# EAGLE design turntable_final (EAGLE 8.1.0)
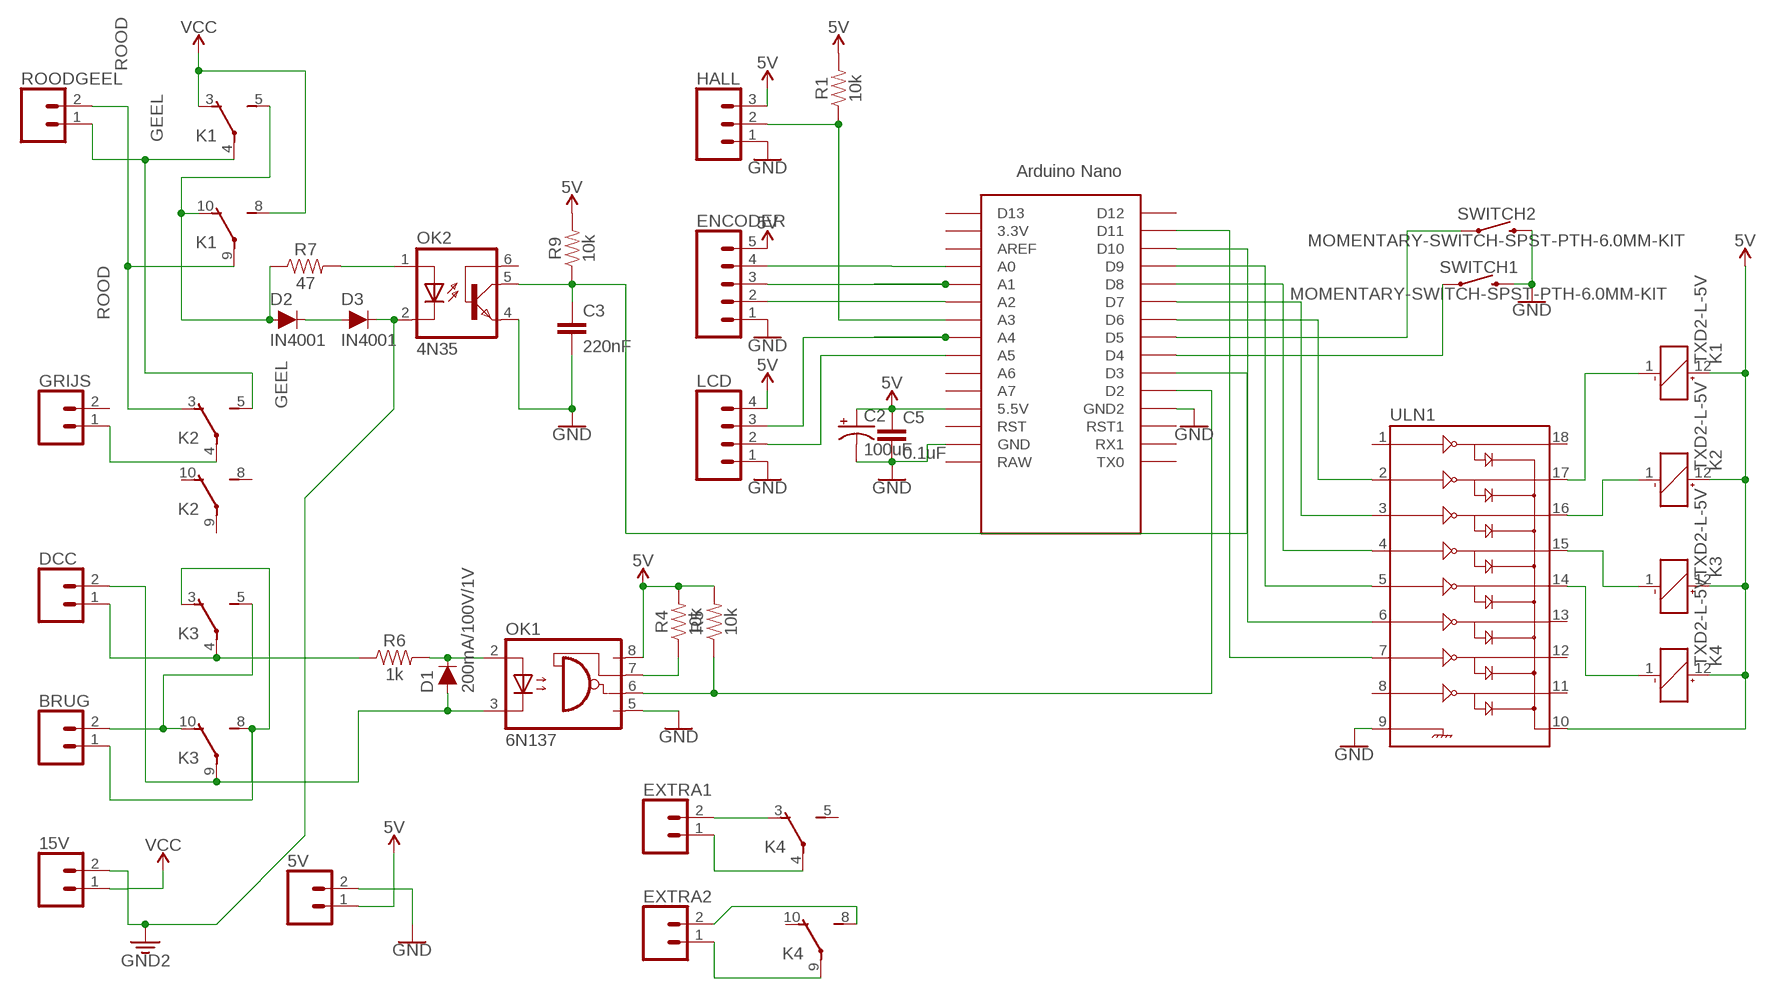
[diagram p0: schematic, sheet 1]

## Parts
5V  CONN_023.5MM_LOCK  [SCREWTERMINAL-3.5MM-2_LOCK]
15V  CONN_023.5MM_LOCK  [SCREWTERMINAL-3.5MM-2_LOCK]
BRUG  CONN_023.5MM_LOCK  [SCREWTERMINAL-3.5MM-2_LOCK]
C2  100uF  10UF-POLAR-RADIAL-2.5MM-25V-20%  [CPOL-RADIAL-2.5MM-5MM]
C3  220nF  0.1UF-KIT-EZ-50V-20%  [CAP-PTH-SMALL-KIT]
C5  0.1uF  0.1UF-KIT-EZ-50V-20%  [CAP-PTH-SMALL-KIT]
D1  200mA/100V/1V  DIODE-1N4148  [DIODE-1N4148]
D2  IN4001  DIODE-PTH  [DIODE-1N4001]
D3  IN4001  DIODE-PTH  [DIODE-1N4001]
DCC  CONN_023.5MM_LOCK  [SCREWTERMINAL-3.5MM-2_LOCK]
ENCODER  CONN_05  [1X05]
EXTRA1  CONN_023.5MM_LOCK  [SCREWTERMINAL-3.5MM-2_LOCK]
EXTRA2  CONN_023.5MM_LOCK  [SCREWTERMINAL-3.5MM-2_LOCK]
GRIJS  CONN_023.5MM_LOCK  [SCREWTERMINAL-3.5MM-2_LOCK]
HALL  CONN_03  [1X03]
K1  TXD2-L-5V  [TXD2]
K2  TXD2-L-5V  [TXD2]
K3  TXD2-L-5V  [TXD2]
K4  TXD2-L-5V  [TXD2]
LCD  CONN_04  [1X04]
OK1  6N137  [DIL08]
OK2  4N35  [DIL06]
R1  10k  10KOHM-HORIZ-1/4W-1%  [AXIAL-0.3]
R4  10k  10KOHM-HORIZ-1/4W-1%  [AXIAL-0.3]
R5  10k  10KOHM-HORIZ-1/4W-1%  [AXIAL-0.3]
R6  1k  1KOHM-HORIZ-1/4W-1%  [AXIAL-0.3]
R7  47  100OHM-HORIZ-1/4W-1%  [AXIAL-0.3]
R9  10k  10KOHM-HORIZ-1/4W-1%  [AXIAL-0.3]
ROODGEEL  CONN_023.5MM_LOCK  [SCREWTERMINAL-3.5MM-2_LOCK]
SWITCH1  MOMENTARY-SWITCH-SPST-PTH-6.0MM-KIT  [TACTILE_SWITCH_PTH_6.0MM_KIT]
SWITCH2  MOMENTARY-SWITCH-SPST-PTH-6.0MM-KIT  [TACTILE_SWITCH_PTH_6.0MM_KIT]
U$1  NANO  [NANO]
ULN1  ULN2803DIP  [DIL18]

## Nets
5V: 5V.1 C2.1(+) C5.1 ENCODER.5 HALL.3 K1.12(_:+) K2.12(_:+) K3.12(_:+) K4.12(_:+) LCD.4 OK1.8(VCC) R1.P$2 R4.P$2 R5.P$2 R9.P$2 U$1.5V(5.5V) ULN1.10
GEEL: K1.4(P) K2.5(S) ROODGEEL.1
GND: 5V.2 C2.2(-) C3.2 C5.2 ENCODER.1 HALL.1 LCD.1 OK1.5(GND) OK2.4(EMI) SWITCH1.3 SWITCH2.3 U$1.GND U$1.GND1(GND2) ULN1.9
GND2: 15V.2 D3.C OK2.2(C)
N$1: HALL.2 R1.P$1 U$1.A3
N$2: K3.1(_:-) ULN1.15
N$4: K1.1(_:-) ULN1.17
N$5: ENCODER.3 U$1.A1
N$6: EXTRA2.1 K4.9(P)
N$7: K4.1(_:-) ULN1.14
N$8: OK1.7(VE) R4.P$1
N$9: DCC.1 K3.4(P) R6.P$1
N$10: D1.A DCC.2 K3.9(P) OK1.3(C)
N$11: ENCODER.4 U$1.A0
N$12: K2.1(_:-) ULN1.16
N$13: OK1.6(VO) R5.P$1 U$1.D2
N$14: D1.C OK1.2(A) R6.P$2
N$15: ENCODER.2 U$1.A2
N$16: BRUG.2 K3.5(S) K3.10(O)
N$17: BRUG.1 K3.3(O) K3.8(S)
N$18: D2.C D3.A
N$19: U$1.D10 ULN1.6
N$20: OK2.1(A) R7.P$2
N$21: EXTRA1.2 K4.3(O)
N$22: C3.1 OK2.5(COL) R9.P$1 U$1.D3
N$23: SWITCH1.1 U$1.D4
N$24: SWITCH2.1 U$1.D5
N$25: GRIJS.1 K2.4(P)
N$26: EXTRA1.1 K4.4(P)
N$27: D2.A K1.5(S) K1.10(O) R7.P$1
N$28: EXTRA2.2 K4.8(S)
N$29: U$1.D9 ULN1.5
N$30: U$1.D8 ULN1.4
N$31: U$1.D7 ULN1.3
N$32: U$1.D6 ULN1.2
N$33: LCD.3 U$1.A4
N$34: LCD.2 U$1.A5
N$35: U$1.D11 ULN1.7
ROOD: K1.9(P) K2.3(O) ROODGEEL.2
VCC: 15V.1 K1.3(O) K1.8(S)
Unconnected: GRIJS.2 K2.8(S) K2.9(P) K2.10(O) K4.5(S) K4.10(O) OK2.6(BAS) U$1.3.3V U$1.A6 U$1.A7 U$1.AREF U$1.D12 U$1.D13 U$1.ICSP1 U$1.ICSP2 U$1.ICSP3 U$1.ICSP4 U$1.ICSP5 U$1.ICSP6 U$1.RAW U$1.RST U$1.RST1 U$1.RX1 U$1.TX0 ULN1.1 ULN1.8 ULN1.11 ULN1.12 ULN1.13 ULN1.18

## Library data of the parts
5V 15V BRUG DCC EXTRA1 EXTRA2 GRIJS ROODGEEL = SparkFun-Connectors:CONN_02: Multi connection point. Often used as Generic Header-pin footprint for 0.1 inch spaced/style header connections On any of the 0.1 inch spaced packages, you can populate with these: Break Away Headers - Straight <https://www.sparkfun.com/products/116> (PRT-00116) Break Away Male Headers - Right Angle <https://www.sparkfun.com/products/553> (PRT-00553) Female Headers <https://www.sparkfun.com/products/115> (PRT-00115) Break Away Headers - Machine Pin <https://www.sparkfun.com/products/117> (PRT-00117) Break Away Female Headers - Swiss Machine Pin <https://www.sparkfun.com/products/743> (PRT-00743) For SCREWTERMINALS and SPRING TERMINALS visit here: Screw Terimnals on SparkFun.com <https://www.sparkfun.com/search/results?term=Screw+Terminals> (5mm/3.5mm/2.54mm spacing) This device is also useful as a general connection point to wire up your design to another part of your project. Our various solder wires solder well into these plated through hole pads. Hook-Up Wire - Assortment (Stranded, 22 AWG) <https://www.sparkfun.com/products/11375> (PRT-11375) Hook-Up Wire - Assortment (Solid Core, 22 AWG) <https://www.sparkfun.com/products/11367> (PRT-11367) View the entire wire category on our website here <https://www.sparkfun.com/categories/141> Special notes: Molex polarized connector foot print use with: PRT-08233 with associated crimp pins and housings. 2.54_SCREWTERM for use with PRT-10571. 3.5mm Screw Terminal footprints for PRT-08084 5mm Screw Terminal footprints for use with PRT-08432; PROD_ID: CONN-08399
C2 = SparkFun-Capacitors:10UF-POLAR: 10.0µF polarized capacitors A capacitor is a passive two-terminal electrical component used to store electrical energy temporarily in an electric field.; PROD_ID: CAP-08440; VALUE: 10uF
C3 = SparkFun-Capacitors:0.1UF: 0.1µF ceramic capacitors A capacitor is a passive two-terminal electrical component used to store electrical energy temporarily in an electric field.; PROD_ID: CAP-08370; VALUE: 0.1uF
C5 = SparkFun-Capacitors:0.1UF: 0.1µF ceramic capacitors A capacitor is a passive two-terminal electrical component used to store electrical energy temporarily in an electric field.; PROD_ID: CAP-08370
D1 = SparkFun-DiscreteSemi:DIODE: Diode These are standard reverse protection diodes and small signal diodes. SparkFun Products: SparkFun SparkPunk Sound Kit <https://www.sparkfun.com/products/11177> SparkFun ESP8266 Thing <https://www.sparkfun.com/products/13231>; PROD_ID: DIO-08378
D2 D3 = SparkFun-DiscreteSemi:DIODE: Diode These are standard reverse protection diodes and small signal diodes. SparkFun Products: SparkFun SparkPunk Sound Kit <https://www.sparkfun.com/products/11177> SparkFun ESP8266 Thing <https://www.sparkfun.com/products/13231>; PROD_ID: DIO-09176; VALUE: 1A/50V/1.1V
ENCODER = SparkFun-Connectors:CONN_05: Multi connection point. Often used as Generic Header-pin footprint for 0.1 inch spaced/style header connections On any of the 0.1 inch spaced packages, you can populate with these: Break Away Headers - Straight <https://www.sparkfun.com/products/116> (PRT-00116) Break Away Male Headers - Right Angle <https://www.sparkfun.com/products/553> (PRT-00553) Female Headers <https://www.sparkfun.com/products/115> (PRT-00115) Break Away Headers - Machine Pin <https://www.sparkfun.com/products/117> (PRT-00117) Break Away Female Headers - Swiss Machine Pin <https://www.sparkfun.com/products/743> (PRT-00743) For SCREWTERMINALS and SPRING TERMINALS visit here: Screw Terimnals on SparkFun.com <https://www.sparkfun.com/search/results?term=Screw+Terminals> (5mm/3.5mm/2.54mm spacing) This device is also useful as a general connection point to wire up your design to another part of your project. Our various solder wires solder well into these plated through hole pads. Hook-Up Wire - Assortment (Stranded, 22 AWG) <https://www.sparkfun.com/products/11375> (PRT-11375) Hook-Up Wire - Assortment (Solid Core, 22 AWG) <https://www.sparkfun.com/products/11367> (PRT-11367) View the entire wire category on our website here <https://www.sparkfun.com/categories/141> Special notes: Molex polarized connector foot print use with SKU : PRT-08231 with associated crimp pins and housings. 1MM SMD Version SKU: PRT-10208
HALL = SparkFun-Connectors:CONN_03: Multi connection point. Often used as Generic Header-pin footprint for 0.1 inch spaced/style header connections On any of the 0.1 inch spaced packages, you can populate with these: Break Away Headers - Straight <https://www.sparkfun.com/products/116> (PRT-00116) Break Away Male Headers - Right Angle <https://www.sparkfun.com/products/553> (PRT-00553) Female Headers <https://www.sparkfun.com/products/115> (PRT-00115) Break Away Headers - Machine Pin <https://www.sparkfun.com/products/117> (PRT-00117) Break Away Female Headers - Swiss Machine Pin <https://www.sparkfun.com/products/743> (PRT-00743) Stackable Header - 3 Pin (Female, 0.1") <https://www.sparkfun.com/products/13875> (PRT-13875) For SCREWTERMINALS and SPRING TERMINALS visit here: Screw Terimnals on SparkFun.com <https://www.sparkfun.com/search/results?term=Screw+Terminals> (5mm/3.5mm/2.54mm spacing) This device is also useful as a general connection point to wire up your design to another part of your project. Our various solder wires solder well into these plated through hole pads. Hook-Up Wire - Assortment (Stranded, 22 AWG) <https://www.sparkfun.com/products/11375> (PRT-11375) Hook-Up Wire - Assortment (Solid Core, 22 AWG) <https://www.sparkfun.com/products/11367> (PRT-11367) View the entire wire category on our website here <https://www.sparkfun.com/categories/141> Special notes: Molex polarized connector foot print use with SKU : PRT-08232 with associated crimp pins and housings.
K1-K4 = relay:TX?-*: TX Relais NAiS TX-D RELAYS HIGH INSULATION Conforming to the supplementary insulation class of EN Standards (EN41003) Source: http://www.mew-europe.com/.. en_ds_61022_0007.pdf TX-S RELAYS SMALL POLARIZED RELAY WITH HIGH SENSITIVITY 50mW Source: http://www.mew-europe.com/.. en_ds_61022_0022.pdf; OC_FARNELL: unknown; OC_NEWARK: unknown
LCD = SparkFun-Connectors:CONN_04: Multi connection point. Often used as Generic Header-pin footprint for 0.1 inch spaced/style header connections On any of the 0.1 inch spaced packages, you can populate with these: Break Away Headers - Straight <https://www.sparkfun.com/products/116> (PRT-00116) Break Away Male Headers - Right Angle <https://www.sparkfun.com/products/553> (PRT-00553) Female Headers <https://www.sparkfun.com/products/115> (PRT-00115) Break Away Headers - Machine Pin <https://www.sparkfun.com/products/117> (PRT-00117) Break Away Female Headers - Swiss Machine Pin <https://www.sparkfun.com/products/743> (PRT-00743) For SCREWTERMINALS and SPRING TERMINALS visit here: Screw Terimnals on SparkFun.com <https://www.sparkfun.com/search/results?term=Screw+Terminals> (5mm/3.5mm/2.54mm spacing) This device is also useful as a general connection point to wire up your design to another part of your project. Our various solder wires solder well into these plated through hole pads. Hook-Up Wire - Assortment (Stranded, 22 AWG) <https://www.sparkfun.com/products/11375> (PRT-11375) Hook-Up Wire - Assortment (Solid Core, 22 AWG) <https://www.sparkfun.com/products/11367> (PRT-11367) View the entire wire category on our website here <https://www.sparkfun.com/categories/141> Special notes: Molex polarized connector foot print use with SKU : PRT-08231 with associated crimp pins and housings. 1MM SMD Version SKU: PRT-10208; PROD_ID: CONN-09696
OK1 = optocoupler:6N137: MOTOROLA OPTO COUPLER; MPN: 6N137; OC_FARNELL: 1328376; OC_NEWARK: 52M1895
OK2 = optocoupler:4N35: MOTOROLA OPTO COUPLER; MF: FAIRCHILD SEMICONDUCTOR; MPN: 4N35; OC_FARNELL: 1328375; OC_NEWARK: 72K9946
R1 R4 R5 R9 = SparkFun-Resistors:10KOHM: 10kΩ resistor A resistor is a passive two-terminal electrical component that implements electrical resistance as a circuit element. Resistors act to reduce current flow, and, at the same time, act to lower voltage levels within circuits. - Wikipedia; PROD_ID: RES-12183
R6 = SparkFun-Resistors:1KOHM: 1kΩ resistor A resistor is a passive two-terminal electrical component that implements electrical resistance as a circuit element. Resistors act to reduce current flow, and, at the same time, act to lower voltage levels within circuits. - Wikipedia; PROD_ID: RES-12182
R7 = SparkFun-Resistors:100OHM: 100Ω resistor A resistor is a passive two-terminal electrical component that implements electrical resistance as a circuit element. Resistors act to reduce current flow, and, at the same time, act to lower voltage levels within circuits. - Wikipedia; PROD_ID: RES-12181; VALUE: 100
SWITCH1 SWITCH2 = SparkFun-Switches:MOMENTARY-SWITCH-SPST: Momentary Switch (Pushbutton) - SPST Normally-open (NO) SPST momentary switches (buttons, pushbuttons). Variants PTH-12MM - 12mm square, through-hole Momentary Pushbutton Switch - 12mm Square <https://www.sparkfun.com/products/9190> (COM-09190) PTH-6.0MM, PTH-6.0MM-KIT - 6.0mm square, through-hole Mini Pushbutton Switch <https://www.sparkfun.com/products/97> (COM-00097) KIT package intended for soldering kit's - only one side of pads' copper is exposed. PTH-RIGHT-ANGLE-KIT - Right-angle, through-hole Right Angle Tactile Button <https://www.sparkfun.com/products/10791> - Used on SparkFun BigTime Watch Kit <https://www.sparkfun.com/products/11734> SMD-12MM - 12mm square, surface-mount Tactile Button - SMD (12mm) <https://www.sparkfun.com/products/12993> (COM-12993) Used on SparkFun PicoBoard <https://www.sparkfun.com/products/11888> SMD-4.5MM - 4.5mm Square Trackball Switch Used on SparkFun Blackberry Trackballer Breakout <https://www.sparkfun.com/products/13169> SMD-4.6MMX2.8MM - 4.60mm x 2.80mm, surface mount Used on SparkFun SAMD21 Mini Breakout <https://www.sparkfun.com/products/13664> SMD-5.2MM, SMD-5.2-REDUNDANT - 5.2mm square, surface-mount Mini Pushbutton Switch - SMD <https://www.sparkfun.com/products/8720> (COM-08720) Used on Arduino Pro Mini <https://www.sparkfun.com/products/11114> REDUNDANT package connects both switch circuits together SMD-6.0X3.5MM - 6.0 x 3.5mm, surface mount Momentary Reset Switch SMD <https://www.sparkfun.com/products/8229> (COM-08229) SMD-6.2MM-TALL - 6.2mm square, surface mount Tactile Button - SMD (6mm) <https://www.sparkfun.com/products/12992> Used on SparkFun Digital Sandbox <https://www.sparkfun.com/products/12651> SMD-RIGHT-ANGLE - Right-angle, surface mount Used on SparkFun Block for Intel® Edison - Arduino <https://www.sparkfun.com/products/13036>; PROD_ID: SWCH-08441; SF_SKU: COM-00097
U$1 = Arduino-clone:NANO: Arduino Nano
ULN1 = SparkFun-IC-Special-Function:ULN2803: Darlington Driver(IC-07959, low stock) ULN2803 Darlington array. 500mA max per channel, 8-channel package. Spark Fun Electronics SKU : COM-00312

## Board
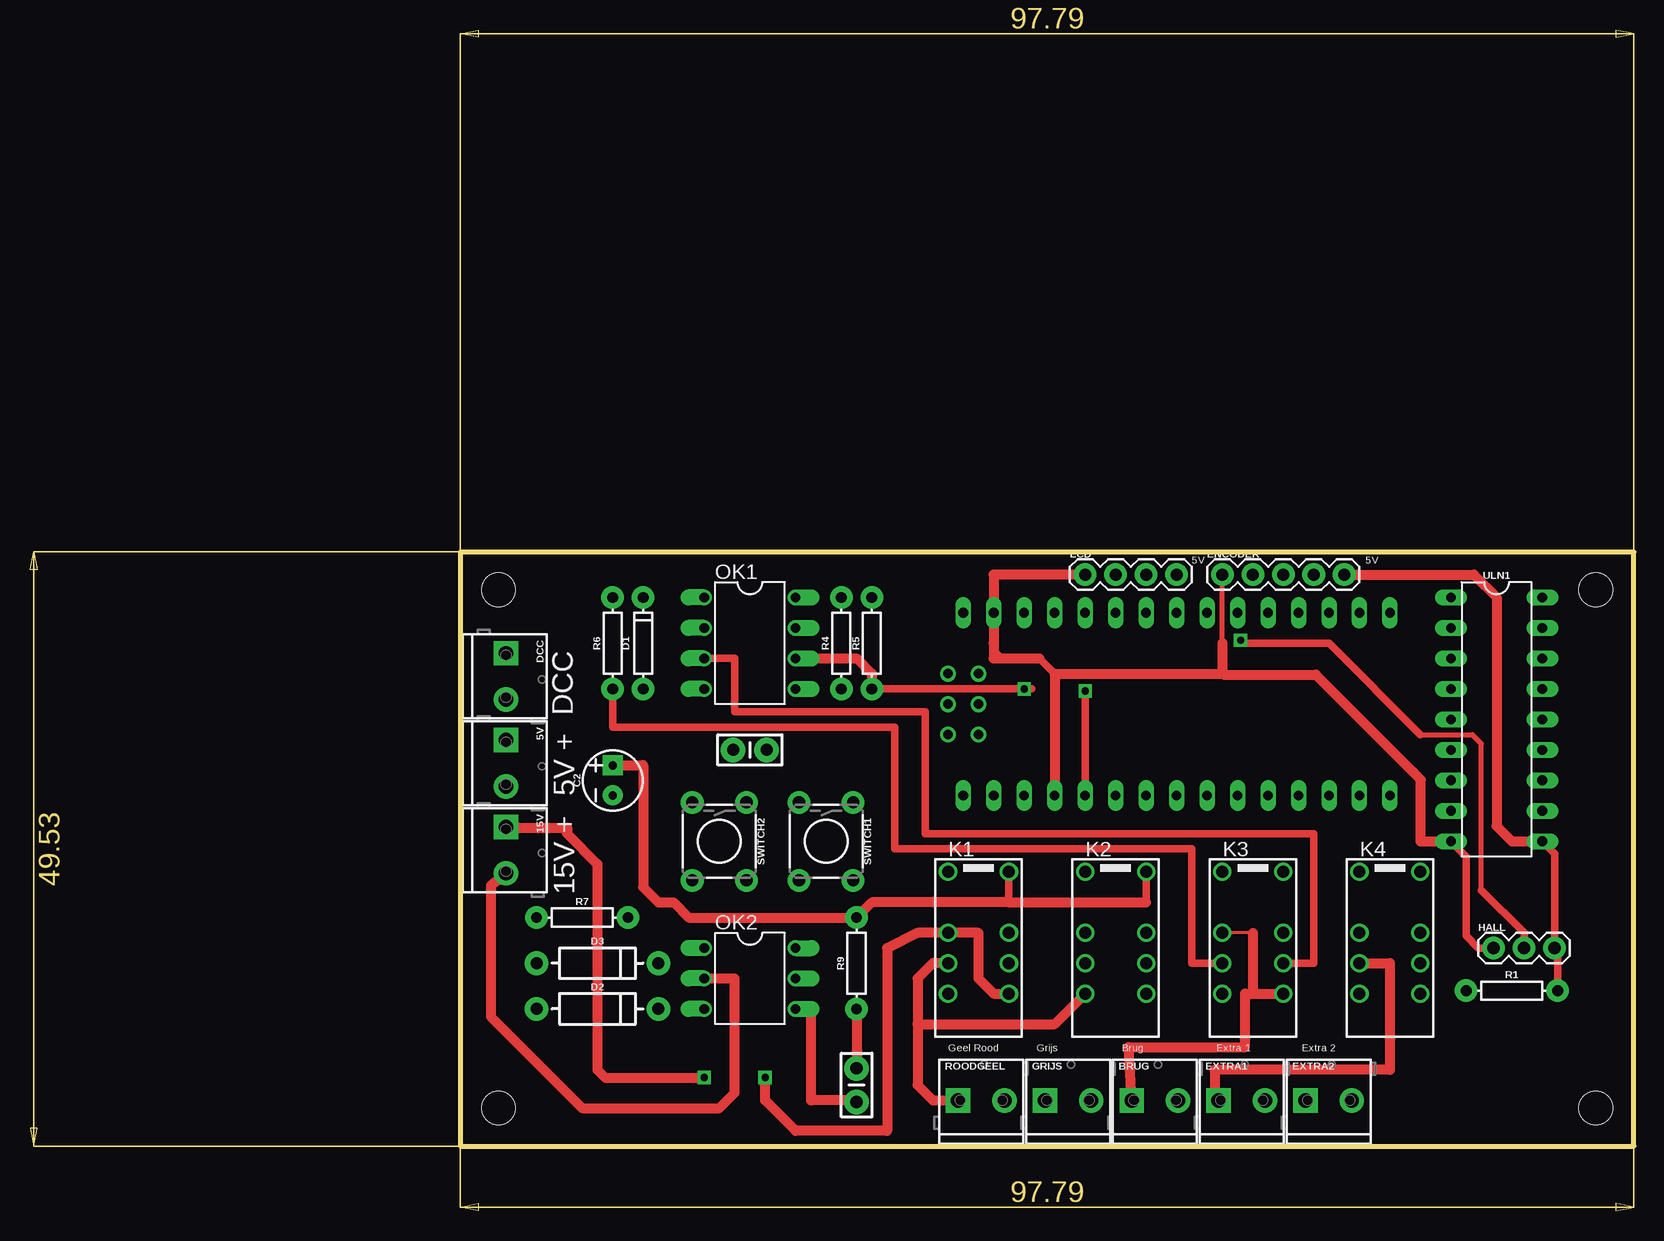
[diagram p1: board, top side]
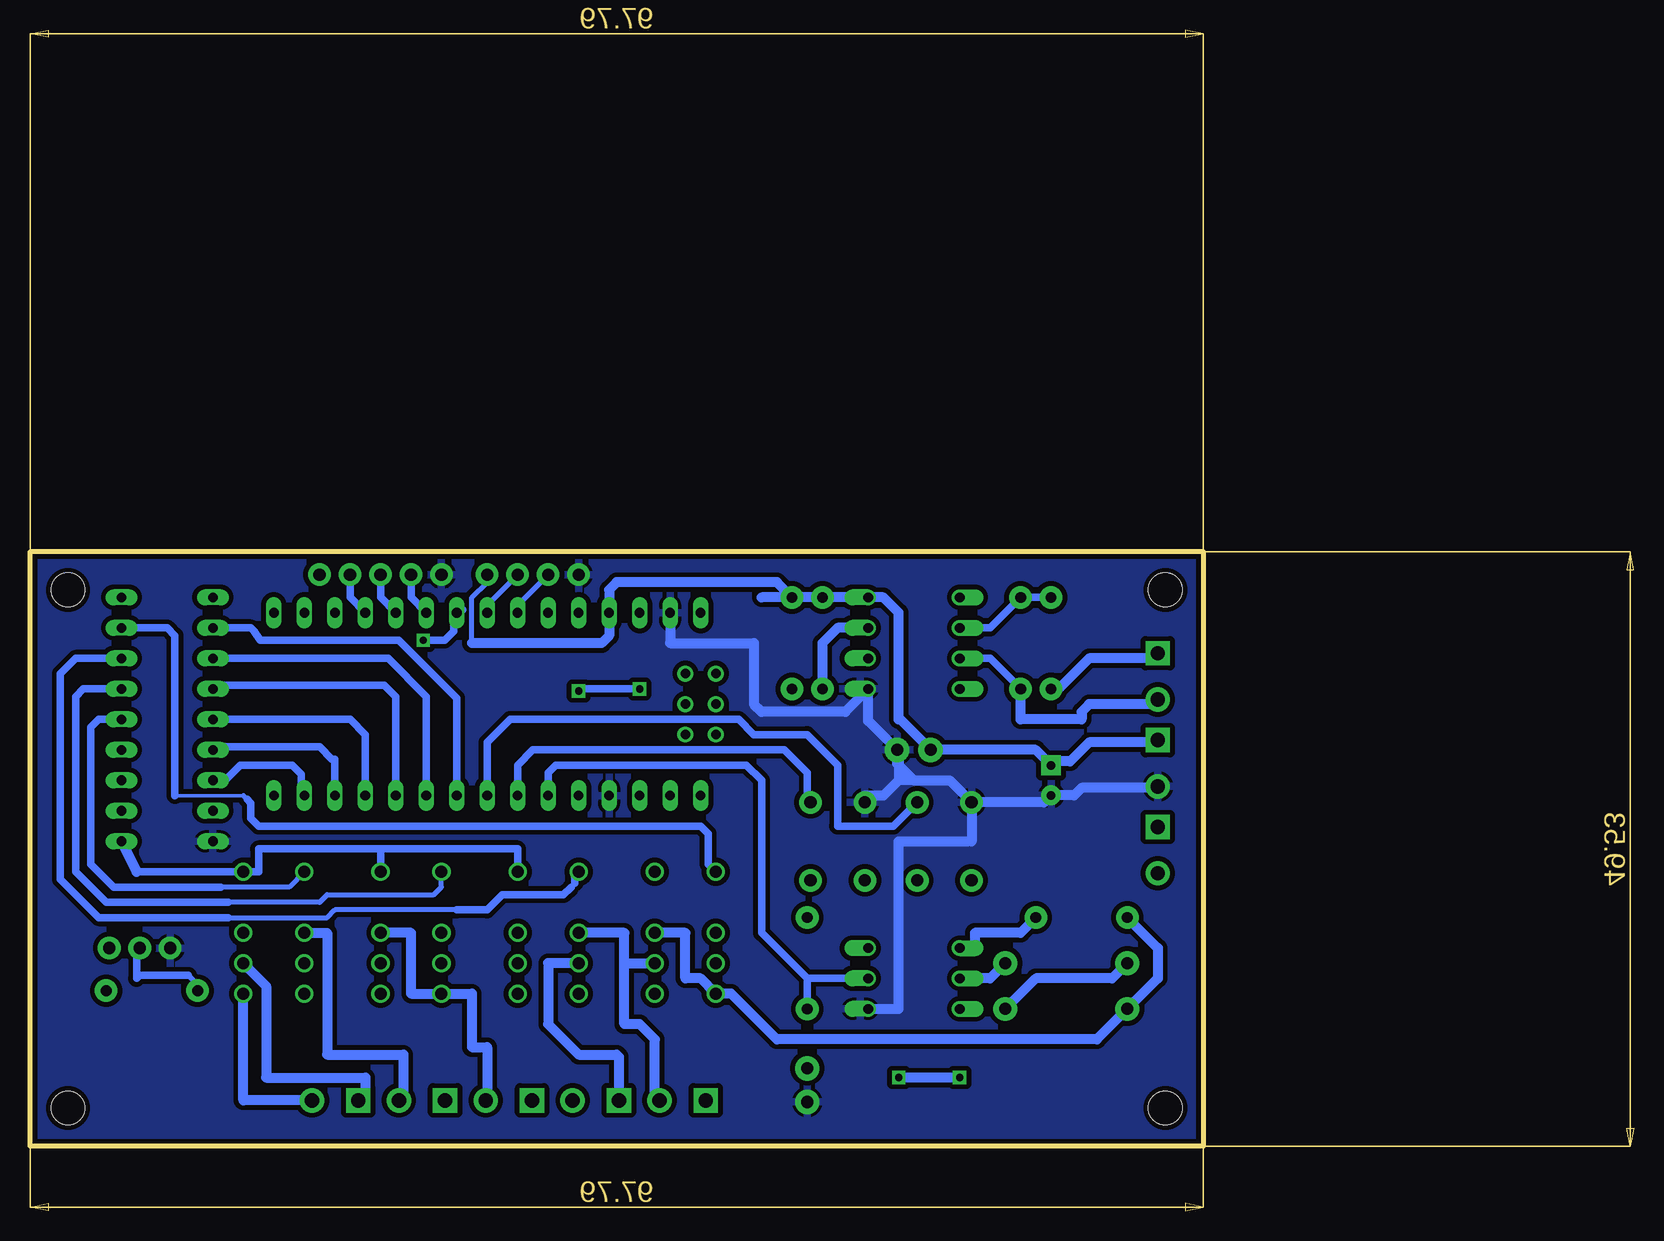
[diagram p2: board, bottom side, seen from below]

Size 97.79 x 49.53 mm. Coordinates in mm from the lower left corner, seen from the top.
Outline: 0,49.53 0,0 97.79,0 97.79,49.53 0,49.53
Copper layers (1*16): Top 0.035mm / dielectric 1.5mm / Bottom 0.035mm
Design rules "SparkFun-2-layer-STANDARD *": minimum track width 10mil, minimum drill 20mil, track to track 10mil, track to pad 8mil, pad to pad 8mil, via to via 10mil, smd to smd 8mil, copper to edge 8mil, drill to drill 8mil, minimum pad ring 10mil, minimum via ring 10mil, stop-mask expansion 4mil, vias tented up to drill 25mil, thermal gap 10mil
Holes 2.8 mm at 3.18,46.36 94.62,46.36 3.18,3.17 94.62,3.17

### Footprints (pad centres in the part's own frame; a part is rotated, then mirrored left to right if it is on the bottom)
SCREWTERMINAL-3.5MM-2_LOCK = drill 1.2 pad 2.032 square: 1 -0.178,0 | drill 1.2 pad 2.032: 2 3.678,0
CPOL-RADIAL-2.5MM-5MM = drill 0.7 pad 1.651 square: 1 1.25,0 | drill 0.7 pad 1.651: 2 -1.25,0
CAP-PTH-SMALL-KIT = drill 1.016 pad 2.032: 1 -1.397,0; 2 1.397,0
DIODE-1N4148 = drill 0.9 pad 1.88: A -3.81,0; C 3.81,0
DIODE-1N4001 = drill 1 pad 1.981: A -5.08,0; C 5.08,0
1X05 = drill 1.016 pad 1.88: 1 0,0; 2 2.54,0; 3 5.08,0; 4 7.62,0; 5 10.16,0
1X03 = drill 1.016 pad 1.88: 1 0,0; 2 2.54,0; 3 5.08,0
TXD2 = drill 1: 1 -6.35,-2.54; 3 -1.27,-2.54; 4 1.27,-2.54; 5 3.81,-2.54; 8 3.81,2.54; 9 1.27,2.54; 10 -1.27,2.54; 12 -6.35,2.54
1X04 = drill 1.016 pad 1.88: 1 0,0; 2 2.54,0; 3 5.08,0; 4 7.62,0
DIL08 = drill 0.813 offset: 1 -3.81,-3.81; 2 -1.27,-3.81; 3 1.27,-3.81; 4 3.81,-3.81; 5 3.81,3.81; 6 1.27,3.81; 7 -1.27,3.81; 8 -3.81,3.81
DIL06 = drill 0.813 offset: 1 -2.54,-3.81; 2 0,-3.81; 3 2.54,-3.81; 4 2.54,3.81; 5 0,3.81; 6 -2.54,3.81
AXIAL-0.3 = drill 0.9 pad 1.88: P$1 -3.81,0; P$2 3.81,0
TACTILE_SWITCH_PTH_6.0MM_KIT = drill 1.016 pad 1.88: 1 -3.251,2.261; 2 3.251,2.261; 3 -3.251,-2.261; 4 3.251,-2.261
NANO = drill 0.8 long: 3.3V -10.16,24.13; 5V -10.16,-1.27; A0 -10.16,19.05; A1 -10.16,16.51; A2 -10.16,13.97; A3 -10.16,11.43; A4 -10.16,8.89; A5 -10.16,6.35; A6 -10.16,3.81; A7 -10.16,1.27; AREF -10.16,21.59; D2 5.08,1.27; D3 5.08,3.81; D4 5.08,6.35; D5 5.08,8.89; D6 5.08,11.43; D7 5.08,13.97; D8 5.08,16.51; D9 5.08,19.05; D10 5.08,21.59; D11 5.08,24.13; D12 5.08,26.67; D13 -10.16,26.67; GND -10.16,-6.35; GND1 5.08,-1.27; RAW -10.16,-8.89; RST -10.16,-3.81; RST1 5.08,-3.81; RX1 5.08,-6.35; TX0 5.08,-8.89 | drill 0.8: ICSP1 -5.08,-10.16; ICSP2 -5.08,-7.62; ICSP3 -2.54,-10.16; ICSP4 -2.54,-7.62; ICSP5 0,-10.16; ICSP6 0,-7.62
DIL18 = drill 0.813 long: 1 -10.16,-3.81; 2 -7.62,-3.81; 3 -5.08,-3.81; 4 -2.54,-3.81; 5 0,-3.81; 6 2.54,-3.81; 7 5.08,-3.81; 8 7.62,-3.81; 9 10.16,-3.81; 10 10.16,3.81; 11 7.62,3.81; 12 5.08,3.81; 13 2.54,3.81; 14 0,3.81; 15 -2.54,3.81; 16 -5.08,3.81; 17 -7.62,3.81; 18 -10.16,3.81

### Placement (x,y rotation side)
5V  3.81,33.66 270 top
15V  3.81,26.42 270 top
BRUG  56.13,3.81 0 top
C2  12.7,30.48 90 top
C3  33.02,5.08 270 top
C5  24.13,33.02 0 top
D1  15.24,41.91 90 top
D2  11.43,11.43 0 top
D3  11.43,15.24 0 top
DCC  3.81,40.89 270 top
ENCODER  63.5,47.62 0 top
EXTRA1  63.37,3.81 0 top
EXTRA2  70.61,3.81 0 top
GRIJS  48.89,3.81 0 top
HALL  86.11,16.51 0 top
K1  43.18,16.51 270 top
K2  54.61,16.51 270 top
K3  66.04,16.51 270 top
K4  77.47,16.51 270 top
LCD  52.07,47.62 0 top
OK1  24.13,41.91 270 top
OK2  24.13,13.97 270 top
R1  87.63,12.95 0 top
R4  31.75,41.91 90 top
R5  34.29,41.91 90 top
R6  12.7,41.91 90 top
R7  10.16,19.05 0 top
R9  33.02,15.24 90 top
ROODGEEL  41.66,3.81 0 top
SWITCH1  30.48,25.4 270 top
SWITCH2  21.59,25.4 270 top
U$1  50.8,34.29 270 top
ULN1  86.36,35.56 270 top

### Tracks (layer width: path | path; a pad name or v marks a point on that pad's centre or on a via)
5V
  Top 0.61: 57.15,20.32 K2.12 | K1.12 45.72,20.32 | ULN1.10 91.19,24.38 HALL.3 91.44,16.26 R1.P$2
  Top 0.813: C2.1 12.7,31.75 15.24,31.75 15.24,21.59 16.51,20.32 17.78,20.32 19.05,19.05 R9.P$2 34.29,20.32 45.72,20.32 57.15,20.32 | ENCODER.5 84.45,47.62 86.36,45.72 86.36,26.67 87.63,25.4 ULN1.10
  Bottom 0.406: 60.96,41.91 60.96,45.72 59.69,46.99 LCD.4
  Bottom 0.61: 88.9,22.86 K4.12 78.74,22.86 78.74,24.76 68.58,24.76 | K2.12 57.15,24.76 68.58,24.76 | 68.58,24.76 K3.12
  Bottom 0.813: 13.03,32.06 C2.1 | 13.03,32.06 13.99,33.02 C5.1 25.27,35.56 25.4,35.56 25.4,44.45 26.67,45.72 OK1.8 | OK1.8 29.21,45.72 | OK1.8 R4.P$2 R5.P$2 | R5.P$2 36.83,45.72 | ULN1.10 88.9,22.86 | R5.P$2 35.56,46.99 48.89,46.99 49.53,46.36 U$1.5V 49.53,42.55 50.16,41.91 60.96,41.91 | 5V.1 3.99,33.66 9.53,33.66 11.12,32.06 13.03,32.06
GEEL
  Top 0.813: K1.4 39.37,15.24 38.1,13.97 38.1,10.16 | 38.1,10.16 38.1,5.08 39.37,3.81 ROODGEEL.1 | 38.1,10.16 49.53,10.16 K2.5
GND
  Top 0.406: 63.5,41.91 ENCODER.1
  Top 0.61: 44.45,41.91 44.45,41.27 45.08,40.64 | 49.53,39.37 48.26,40.64 46.35,40.64 | ULN1.9 83.82,24.13 83.82,17.53 84.84,16.51 HALL.1
  Top 0.813: 63.5,39.37 49.53,39.37 U$1.GND1 49.53,28.57 | 63.5,41.91 63.5,39.37 | 48.26,40.64 44.45,40.64 44.45,41.91 U$1.GND 44.45,47.62 LCD.1 | 33.02,3.81 29.21,3.81 29.21,11.43 OK2.4 29.53,11.43 | 33.65,3.81 33.02,3.81 | 33.02,3.81 C3.2 | 79.42,31.16 80.01,30.56 80.01,25.4 | 80.01,25.4 ULN1.9 | 80.01,25.4 80.05,25.44 80.05,30.52 71.29,39.28 63.59,39.28 63.5,39.37
  Bottom 0.254: 28.26,29.21 28.26,28.73 28.19,28.7 SWITCH1.3
  Bottom 0.61: 19.33,25.4 19.68,25.4 20.96,25.4
  Bottom 0.813: 24.13,30.48 25.53,31.88 C5.2 | C5.2 27.94,35.43 OK1.5 29.84,36.19 36.83,36.19 37.46,36.83 37.46,41.91 44.45,41.91 U$1.GND | OK2.4 25.4,11.43 25.4,25.4 19.68,25.4 | 24.13,30.48 21.16,30.48 SWITCH2.3 | 28.26,29.21 26.67,29.21 25.4,30.48 | C5.2 25.4,32.89 25.4,30.48 | SWITCH2.3 19.33,25.4 | 24.13,30.48 25.4,30.48 | 3.94,29.84 10.16,29.84 10.78,29.23 C2.2 13.28,28.65 SWITCH2.3
  pour Bottom (isolate 0.406): 0,49.28 arc-90 0.25,49.53 97.54,49.53 97.54,0.25 arc-90 97.28,0 arc90 97.03,0.25 0.25,0.25 0.51,49.28
GND2
  Top 0.813: OK2.2 22.86,13.97 22.86,4.44 21.59,3.17 10.16,3.17 2.54,10.79 2.54,21.72 15V.2
  Bottom 0.813: D3.C 17.78,13.97 OK2.2
N$1  (via drill 0.6)
  Top 0.406: 80.01,34.29 84.33,34.29 85.09,33.53 85.09,21.34
  Top 0.61: v65.02,42.16 65.28,41.91 72.39,41.91 80.01,34.29 | HALL.2 88.65,17.78 85.09,21.34
  Bottom 0.406: 84.58,14.22 83.82,13.46 R1.P$1
  Bottom 0.61: v65.02,42.16 63.25,42.16 62.48,42.93 62.48,44.2 U$1.A3 61.98,44.7 61.72,44.7 | HALL.2 88.9,16.26 88.9,13.97 88.65,14.22 84.58,14.22 | R1.P$1 83.57,12.7 83.57,12.45
N$2
  Bottom 0.406: 81.28,20.32 73.66,20.32 73.03,20.96 64.14,20.96 63.5,21.59 K3.1
  Bottom 0.61: 81.28,20.32 91.44,20.32 93.98,22.86 93.98,37.47 93.34,38.1 ULN1.15
N$4
  Bottom 0.305: 80.01,29.21 85.73,29.21
  Bottom 0.406: 79.69,28.89 80.01,29.21
  Bottom 0.61: K1.1 41.27,23.5 41.27,26.04 41.91,26.67 78.74,26.67 79.38,27.3 79.38,28.57 79.69,28.89 | 85.73,29.21 85.73,42.55 86.36,43.18 ULN1.17
N$5
  Bottom 0.61: U$1.A1 68.58,45.72 ENCODER.3
N$6
  Bottom 0.813: EXTRA2.1 69.85,3.81 69.85,5.71 78.11,5.71 78.11,13.33 K4.9
N$7
  Bottom 0.406: K4.1 76.2,21.59 81.92,21.59
  Bottom 0.61: 81.92,21.59 90.81,21.59 92.71,23.5 92.71,34.92 92.08,35.56 ULN1.14
N$8
  Bottom 0.813: OK1.7 30.48,43.18 31.75,41.91 R4.P$1
N$9
  Top 0.61: K3.4 60.96,15.24 60.96,24.76 36.2,24.76 36.2,34.92 12.7,34.92 R6.P$1
  Bottom 0.813: DCC.1 3.99,40.64 9.53,40.64 12.07,38.1 R6.P$1
N$10
  Top 0.61: OK1.3 22.86,40.64 22.86,36.19 38.73,36.19 38.73,26.04 71.12,26.04 71.12,15.24 K3.9
  Bottom 0.61: 15.24,37.47 D1.A 17.78,40.64 OK1.3
  Bottom 0.813: DCC.2 3.94,36.83 9.53,36.83 10.16,36.19 10.16,35.56 15.24,35.56 15.24,37.47
N$11
  Bottom 0.61: U$1.A0 71.12,45.72 ENCODER.4
N$12
  Bottom 0.406: 62.23,19.68 72.39,19.68 73.03,19.05 81.28,19.05 | 52.39,21.91 52.7,21.59
  Bottom 0.61: 81.28,19.05 92.08,19.05 95.25,22.22 95.25,39.37 93.98,40.64 ULN1.16 | K2.1 52.39,22.54 52.39,21.91 | 52.7,21.59 53.34,20.96 58.42,20.96 59.69,19.68 62.23,19.68
N$13  (via drill 0.6)
  Top 0.61: R5.P$1 v46.99,38.1 47.62,38.1 | v52.07,37.93 U$1.D2
  Top 0.813: OK1.6 33.02,40.64 34.29,39.37 R5.P$1
  Bottom 0.61: v46.99,38.1 52.07,38.1 v52.07,37.93
N$14
  Bottom 0.61: R6.P$2 D1.C 17.78,43.18 OK1.2
N$15
  Bottom 0.61: U$1.A2 66.04,45.72 ENCODER.2
N$16
  Bottom 0.813: K3.10 66.04,17.78 66.04,12.7 K3.5 60.96,12.7 60.96,8.25 59.69,8.25 59.69,3.81 BRUG.2
N$17
  Top 0.254: 66.04,17.78 K3.3
  Top 0.813: 66.04,17.78 66.04,12.7 | 66.04,12.7 K3.8 | BRUG.1 55.7,8.25 65.41,8.25 65.41,12.7 66.04,12.7
N$18
  Bottom 0.813: D3.A 7.62,13.97 13.97,13.97 D2.C
N$19
  Bottom 0.61: ULN1.6 82.3,33.27 73.66,33.27 72.64,32.26 72.39,32.26 U$1.D10
N$20
  Bottom 0.813: R7.P$2 15.24,17.78 19.05,17.78 19.05,16.51 OK2.1
N$21
  Bottom 0.813: K4.3 73.03,17.78 73.03,7.62 66.67,7.62 66.67,3.81 EXTRA1.2
N$22
  Top 0.813: R9.P$1 C3.1
  Bottom 0.61: OK2.5 33.02,13.97 | 33.02,13.97 R9.P$1 | 33.02,13.97 36.83,17.78 36.83,30.48 38.1,31.75 53.97,31.75 54.61,31.11 U$1.D3
N$23
  Bottom 0.61: SWITCH1.1 33.02,28.93 33.02,31.11 34.92,33.02 55.88,33.02 57.15,31.75 U$1.D4
N$24
  Bottom 0.61: SWITCH2.1 25.83,26.67 30.48,26.67 30.48,31.75 33.02,34.29 37.46,34.29 38.73,35.56 57.78,35.56 59.69,33.66 U$1.D5
N$25
  Bottom 0.813: K2.4 54.61,15.24 54.61,10.16 52.07,7.62 48.89,7.62 48.72,7.44 GRIJS.1
N$26
  Top 0.813: K4.4 77.47,15.24 77.47,6.35 62.87,6.35 62.87,3.81 EXTRA1.1
N$27
  Bottom 0.813: R7.P$1 3.81,16.51 3.81,13.97 D2.A 8.89,8.89 35.56,8.89 39.37,12.7 K1.5 41.91,13.97 43.18,13.97 43.18,17.78 K1.10
N$28
  Bottom 0.813: EXTRA2.2 80.01,3.81 K4.8
N$29
  Bottom 0.61: ULN1.5 71.12,35.56 69.85,34.29 U$1.D9
N$30
  Bottom 0.61: U$1.D8 67.31,37.47 68.26,38.42 82.23,38.42 ULN1.4
N$31
  Bottom 0.61: ULN1.3 67.95,40.64 64.77,37.47 U$1.D7
N$32
  Bottom 0.254: 79.11,42.86 79.22,42.86 79.14,42.94
  Bottom 0.61: 79.11,42.86 79.06,42.86 | ULN1.2 79.38,43.18 79.14,42.94 78.61,42.16 67.06,42.16 62.23,37.34 U$1.D6
N$33
  Bottom 0.406: LCD.3 59.69,45.08 U$1.A4 59.69,43.81
N$34
  Bottom 0.406: LCD.2 57.15,45.08 U$1.A5 57.15,43.81
N$35
  Bottom 0.61: U$1.D11 75.18,29.46 75.18,30.99 75.95,31.75 80.26,31.75 81.53,30.48 ULN1.7
ROOD
  Bottom 0.254: 46.04,3.81 ROODGEEL.2
  Bottom 0.813: ROODGEEL.2 45.72,3.94 45.72,8.89 46.99,10.16 48.26,10.16 48.26,15.24 | 48.26,15.24 K1.9 | 48.26,15.24 48.26,17.78 K2.3
VCC  (via drill 0.6)
  Top 0.813: K1.8 44.45,12.7 43.18,13.97 43.18,17.78 K1.3 38.1,17.78 35.56,16.51 35.56,1.27 27.94,1.27 25.4,3.81 v25.4,5.71 | v20.32,5.71 12.07,5.71 11.43,6.35 11.43,23.5 8.89,26.04 8.89,26.54 4.12,26.54 15V.1
  Bottom 0.813: v20.32,5.71 v25.4,5.71

### Text on the board
tSilk: 5V | 5V | DCC | 5V + | 15V + | Geel Rood | Grijs | Brug | Extra 1 | Extra 2